# EAGLE design Lone Sleeper (EAGLE 9.5.2)
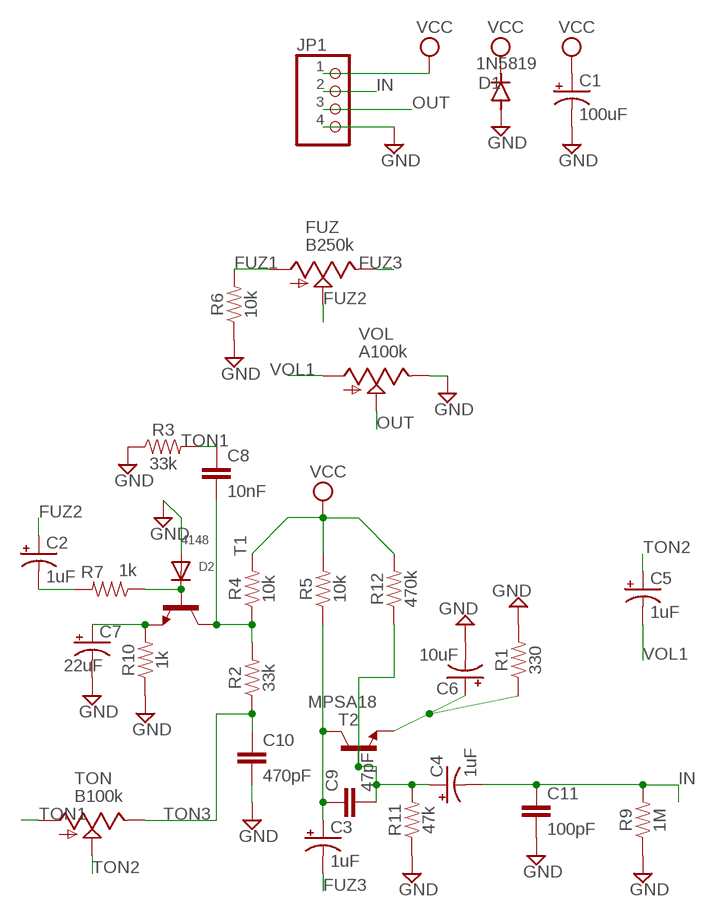
[diagram p0: schematic, sheet 1]

## Parts
C1  100uF  CAP_SMD+THRUPAN_B  [PAN_B_SMD+THRU]
C2  1uF  CAP_SMD+THRUPAN_B  [PAN_B_SMD+THRU]
C3  1uF  CAP_SMD+THRUPAN_B  [PAN_B_SMD+THRU]
C4  1uF  CAP_SMD+THRUPAN_B  [PAN_B_SMD+THRU]
C5  1uF  CAP_SMD+THRUPAN_B  [PAN_B_SMD+THRU]
C6  10uF  CAP_SMD+THRUPAN_B  [PAN_B_SMD+THRU]
C7  22uF  CAP_SMD+THRUPAN_B  [PAN_B_SMD+THRU]
C8  10nF  10NF-0603-50V-10%  [0603]
C9  47pF  47PF-0603-50V-5%  [0603]
C10  470pF  470PF-0603-50V-5%  [0603]
C11  100pF  100PF-0603-50V-5%  [0603]
D1  1N5819  DIODE-SOD123  [SOD123]
D2  4148  DIODESOD-123  [SOD-123]
FUZ  B250k  9MM_SNAP-IN_POT_  [9MM_SNAP-IN_POT]
JP1  PINHD-1X4  [1X04]
R1  330  330OHM-0603-1/10W-1%  [0603]
R2  33k  33KOHM-0603-1/10W-1%  [0603]
R3  33k  33KOHM-0603-1/10W-1%  [0603]
R4  10k  10KOHM-0603-1/10W-1%  [0603]
R5  10k  10KOHM-0603-1/10W-1%  [0603]
R6  10k  10KOHM-0603-1/10W-1%  [0603]
R7  1k  1KOHM-0603-1/10W-1%  [0603]
R9  1M  1MOHM-0603-1/4W-5%  [0603]
R10  1k  1KOHM-0603-1/10W-1%  [0603]
R11  47k  47KOHM-0603-1/10W-1%  [0603]
R12  470k  RESISTOR0603  [0603]
T1  -NPN-TO5  [TO5]
T2  MPSA18  -NPN-TO92-EBC  [TO92-EBC]
TON  B100k  9MM_SNAP-IN_POT_  [9MM_SNAP-IN_POT]
VOL  A100k  9MM_SNAP-IN_POT_  [9MM_SNAP-IN_POT]

## Nets
FUZ1: FUZ.1(A) R6.2
FUZ2: C2.+ C2.++(+) FUZ.2(S)
FUZ3: C3.- C3.--(-) FUZ.3(E)
GND: C1.- C1.--(-) C6.- C6.--(-) C7.- C7.--(-) C10.2 C11.2 D1.A D2.A JP1.4 R1.2 R3.1 R6.1 R9.1 R10.1 R11.1 VOL.3(E)
IN: C4.- C4.--(-) C11.1 JP1.2 R9.2
N$1: C8.2 R2.2 R4.1 T1.3(C)
N$2: C7.+ C7.++(+) R10.2 T1.1(E)
N$3: D2.C R7.1 T1.2(B)
N$4: C2.- C2.--(-) R7.2
N$5: C3.+ C3.++(+) C9.1 R5.1 T2.C
N$6: C4.+ C4.++(+) C9.2 R11.2 R12.1 T2.B
N$7: C6.+ C6.++(+) R1.1 T2.E
OUT: JP1.3 VOL.2(S)
TON1: C8.1 R3.2 TON.1(A)
TON2: C5.+ C5.++(+) TON.2(S)
TON3: C10.1 R2.1 TON.3(E)
VCC: C1.+ C1.++(+) D1.C JP1.1 R4.2 R5.2 R12.2
VOL1: C5.- C5.--(-) VOL.1(A)

## Library data of the parts
C1-C7 = MusicThingModular:CAP_SMD+THRU
C8 = SparkFun-Capacitors:10NF: 0.01uF/10nF/10,000pF ceramic capacitors A capacitor is a passive two-terminal electrical component used to store electrical energy temporarily in an electric field. CAP-09321; PROD_ID: CAP-00867
C9 = SparkFun-Capacitors:47PF: 47pF ceramic capacitors A capacitor is a passive two-terminal electrical component used to store electrical energy temporarily in an electric field.; PROD_ID: CAP-08913
C10 = SparkFun-Capacitors:470PF: 470pF ceramic capacitors A capacitor is a passive two-terminal electrical component used to store electrical energy temporarily in an electric field.; PROD_ID: CAP-07884
C11 = SparkFun-Capacitors:100PF: 100pF/0.1nF ceramic capacitors A capacitor is a passive two-terminal electrical component used to store electrical energy temporarily in an electric field.; PROD_ID: CAP-07883
D1 = diode:DIODE-: DIODE
D2 = adafruit:DIODE: Diode SMADIODE - SMA Surface Mount Package 20V 1A Schottky Diode Digikey: 641-1014-6-ND DO-1N4148 - Through Hole Small Current Diode SOD-123 20V 1 A (.5mV Vf) Schottky Diode - Digikey: MBRX120TPMSCT-ND SOD-323 10V 570mA (.38mV Vf, 3ns) Schottky Diode - Digikey: ZLLS410CT-ND SOD-523 30V 30mA Schottky Diode (RB751S-40TE61) - Digikey: RB751S-40TE61CT-ND SOT23-R/W - SOT23 Package (R = Solder Paste/Reflow Ovens, W = Hand-Soldering) BAT54Film 40V 300mA - Digikey: 497-7162-1-ND
FUZ TON VOL = MusicThingModular:9MM_SNAP-IN_POT: 9mm vertical snap-in pot, Alpha / Panasonic style
JP1 = Connector:PINHD-1X4: PIN HEADER; CATEGORY: CONNECTOR; SUB-CATEGORY: PIN-HEADER
R1 = SparkFun-Resistors:330OHM: 330Ω resistor A resistor is a passive two-terminal electrical component that implements electrical resistance as a circuit element. Resistors act to reduce current flow, and, at the same time, act to lower voltage levels within circuits. - Wikipedia; PROD_ID: RES-00818
R2 R3 = SparkFun-Resistors:33KOHM: 33kΩ resistor A resistor is a passive two-terminal electrical component that implements electrical resistance as a circuit element. Resistors act to reduce current flow, and, at the same time, act to lower voltage levels within circuits. - Wikipedia; PROD_ID: RES-08416
R4-R6 = SparkFun-Resistors:10KOHM: 10kΩ resistor A resistor is a passive two-terminal electrical component that implements electrical resistance as a circuit element. Resistors act to reduce current flow, and, at the same time, act to lower voltage levels within circuits. - Wikipedia; PROD_ID: RES-00824
R7 R10 = SparkFun-Resistors:1KOHM: 1kΩ resistor A resistor is a passive two-terminal electrical component that implements electrical resistance as a circuit element. Resistors act to reduce current flow, and, at the same time, act to lower voltage levels within circuits. - Wikipedia; PROD_ID: RES-07856
R9 = SparkFun-Resistors:1MOHM: 1MΩ resistor A resistor is a passive two-terminal electrical component that implements electrical resistance as a circuit element. Resistors act to reduce current flow, and, at the same time, act to lower voltage levels within circuits. - Wikipedia; PROD_ID: RES-07868
R11 = SparkFun-Resistors:47KOHM: 47kΩ resistor A resistor is a passive two-terminal electrical component that implements electrical resistance as a circuit element. Resistors act to reduce current flow, and, at the same time, act to lower voltage levels within circuits. - Wikipedia; PROD_ID: RES-07871
R12 = SparkFun-Resistors:RESISTOR: Generic Resistor Package
T1 T2 = MusicThingModular:*-NPN-: NPN Transistror BF959 corrected 2008.03.06

## Board
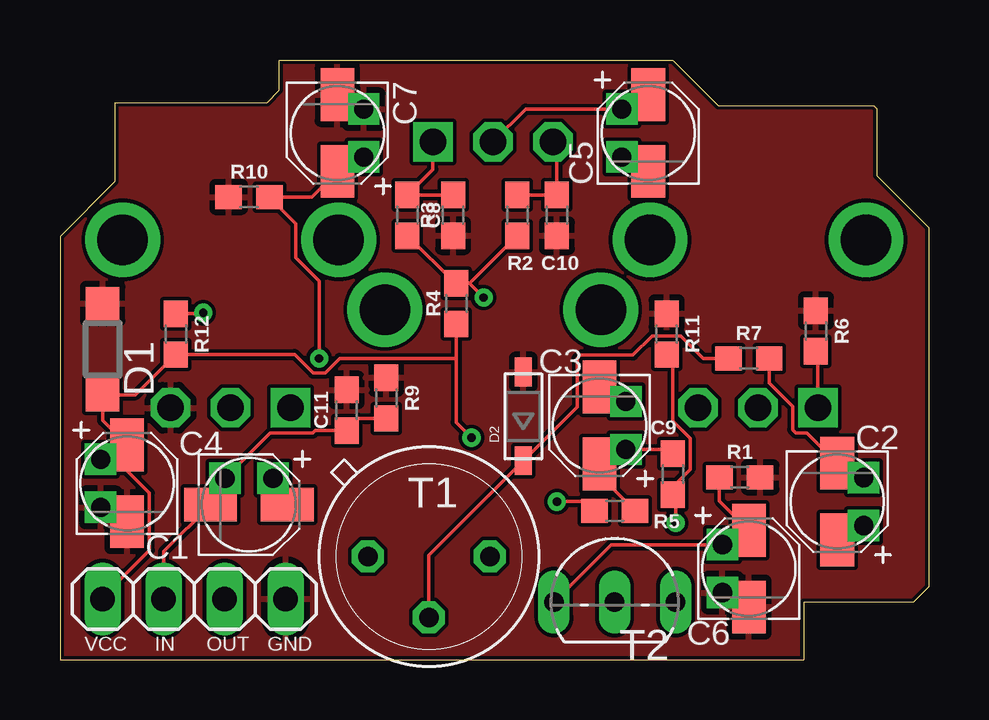
[diagram p1: board, top side]
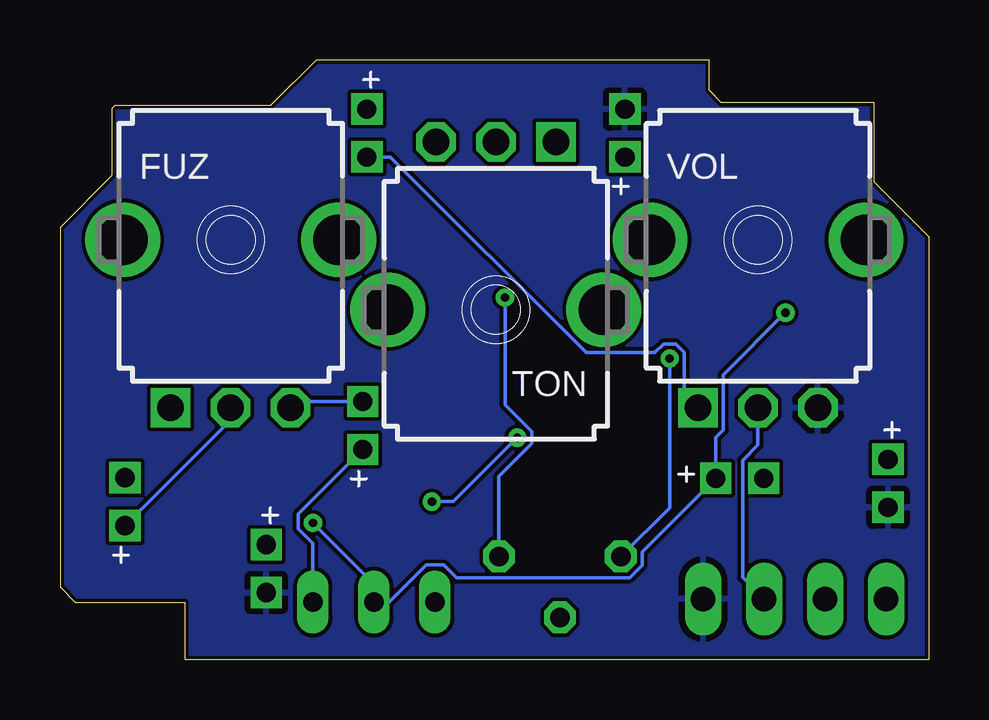
[diagram p2: board, bottom side, seen from below]

Size 36.2 x 25.02 mm. Coordinates in mm from the lower left corner, seen from the top.
Outline: 0,0 30.99,0 30.99,2.41 35.56,2.41 36.2,3.05 36.2,18.03 34.04,20.19 34.04,22.99 33.91,23.11 27.43,23.11 25.53,25.02 9.14,25.02 9.14,23.75 8.64,23.24 2.29,23.24 2.29,19.94 0,17.65 0,0
Copper layers (1*16): Top 0.035mm / dielectric 1.5mm / Bottom 0.035mm
Design rules "default *": minimum track width 6mil, minimum drill 0.35mm, track to track 6mil, track to pad 6mil, pad to pad 6mil, via to via 6mil, smd to smd 6mil, copper to edge 6mil, drill to drill 6mil, minimum pad ring 10mil, minimum via ring 8mil, stop-mask expansion 4mil, vias tented up to drill 0mil, thermal gap 10mil

### Footprints (pad centres in the part's own frame; a part is rotated, then mirrored left to right if it is on the bottom)
PAN_B_SMD+THRU = smd 2.2 x 1.4: + 1.6,0; - -1.6,0 | drill 0.8 pad 0.9 square: ++ 1,1.1; -- -1,1.1
0603 = smd 1.1 x 1: 1 -0.85,0; 2 0.85,0
SOD123 = smd 1.4 x 1.4: A 1.9,0; C -1.9,0
SOD-123 = smd 1.2 x 0.7: A 1.85,0; C -1.85,0
9MM_SNAP-IN_POT = drill 1.1 square: 1 -2.5,-7 | drill 1.1 octagon: 2 0,-7; 3 2.5,-7 | drill 2.1 pad 2.794: CHASSIS1 -4.5,0; CHASSIS2 4.5,0
1X04 = drill 1.016 long: 1 -3.81,0; 2 -1.27,0; 3 1.27,0; 4 3.81,0
TO5 = drill 0.813 octagon: 1 0,-2.54; 2 2.54,0; 3 0,2.54
TO92-EBC = drill 0.813 long: B 0,-1.27; C 2.54,-1.27; E -2.54,-1.27

### Placement (x,y rotation side)
C1  2.79,7.37 90 top
C2  32.38,6.6 270 top
C3  22.48,9.78 270 top
C4  7.87,6.48 0 top
C5  24.51,21.97 90 top
C6  28.7,3.81 90 top
C7  11.56,21.97 270 top
C8  14.48,18.54 270 top
C9  25.53,7.75 270 top
C10  20.7,18.54 270 top
C11  11.94,10.41 90 top
D1  1.78,12.95 90 top
D2  19.3,10.16 90 top
FUZ  29.08,17.52 0 bottom
JP1  5.59,2.54 0 top
R1  28.32,7.62 0 top
R2  19.05,18.54 270 top
R3  16.38,18.54 90 top
R4  16.51,14.86 270 top
R5  23.11,6.22 180 top
R6  31.5,13.72 270 top
R7  28.7,12.57 0 top
R9  13.59,10.92 270 top
R10  7.87,19.3 0 top
R11  25.27,13.59 270 top
R12  4.83,13.59 270 top
T1  15.37,4.32 270 top
T2  23.11,3.68 0 top
TON  18.03,14.61 180 bottom
VOL  7.11,17.52 0 bottom

### Tracks (layer width: path | path; a pad name or v marks a point on that pad's centre or on a via)
FUZ1
  Top 0.152: R6.2 31.58,12.78 FUZ.1
FUZ2
  Top 0.152: C2.+ 32.98,5.6 C2.++
  Bottom 0.152: C2.++ 29.08,10.01 FUZ.2
FUZ3
  Top 0.152: C3.-- 23.08,10.78 C3.-
  Bottom 0.152: C3.-- 26.32,10.78 FUZ.3
GND
  pour Top: -0.51,26.16 -0.51,-0.13 -0.13,-0.51 36.83,-0.51 36.83,26.04 36.7,26.16
  pour Bottom: -0.38,26.04 -0.38,-0.13 0,-0.51 36.83,-0.51 36.96,-0.38 36.96,25.53 36.07,26.42 0,26.42
IN
  Top 0.152: JP1.2 4.32,4.52 C4.- 6.27,6.98 C4.-- 8.76,9.46 10.53,9.46 10.63,9.56 C11.1 12.45,10.07 R9.2
N$1  (via drill 0.35)
  Top 0.152: C8.2 16.46,15.71 R4.1 | R4.1 17.07,15.71 R2.2 | v17.65,15.11 17.06,15.71 R4.1
  Bottom 0.152: T1.3 17.91,7.65 16.54,9.02 16.54,9.52 17.65,10.64 v17.65,15.11
N$2  (via drill 0.35)
  Top 0.152: C7.++ 12.06,20.37 C7.+ 10.49,19.3 R10.2 9.82,18.2 9.82,16.78 10.79,15.81 v10.79,12.57
  Bottom 0.152: v10.79,12.57 10.79,6.35 T1.1
N$3
  Top 0.152: R7.1 26.81,12.57 25.87,13.52 24.68,13.52 23.87,12.71 21.68,12.71 21.55,12.57 21.55,10.56 D2.C 15.37,4.37 T1.2
N$4
  Top 0.152: C2.-- 32.88,8.2 C2.- 31.12,9.46 30.66,9.46 30.53,9.6 30.53,10.56 29.55,11.54 R7.2
N$5
  Top 0.152: R5.1 22.48,7.71 C3.+ 23.08,8.78 C3.++ 25.34,8.78 C9.1
  Bottom 0.152: T2.C 25.65,4.86 26.26,5.46 26.26,6.1 C3.++
N$6  (via drill 0.35)
  Top 0.152: C9.2 25.55,6.88 | 25.55,6.88 25.65,6.77 v25.65,5.71 | C4.+ 8.87,7.08 C4.++ | v5.97,14.48 5.93,14.44 R12.1 | 25.55,6.88 25.55,7.24 26.26,7.95 26.26,9.24 25.53,9.97 25.53,12.48 R11.2
  Bottom 0.152: v25.65,5.71 23.11,3.17 T2.B 22.49,2.41 20.94,3.96 20.21,3.96 19.67,3.43 12.46,3.43 11.94,3.95 11.94,4.51 C4.++ 8.87,9.28 8.56,9.6 8.56,11.89 v5.97,14.48
N$7
  Top 0.152: R1.1 27.47,6.64 C6.+ 28.2,5.41 C6.++ 22.97,4.81 T2.E
OUT
  Bottom 0.152: VOL.2 7.11,8.97 7.76,8.33 7.76,3.44 JP1.3
TON1
  Top 0.152: R3.2 C8.1 15.53,20.45 TON.1
TON2
  Top 0.152: TON.2 19.4,22.97 C5.++ 24.01,23.57 C5.+
TON3
  Top 0.152: TON.3 20.7,21.44 C10.1 R2.1
VCC  (via drill 0.35)
  Top 0.152: JP1.1 1.78,2.63 3.72,4.57 3.72,6.96 2.79,7.89 C1.+ | C1.+ 2.19,8.37 C1.++ | C1.+ 1.78,9.98 D1.C 3.14,11.05 R12.2 9.77,12.74 10.54,11.97 11.05,11.97 11.65,12.57 16.51,12.57 | R4.2 16.51,12.57 | 16.51,12.57 16.51,9.91 v17.14,9.27 | v20.7,6.6 21.88,6.6 R5.2
  Bottom 0.152: v17.14,9.27 19.81,6.6 v20.7,6.6
VOL1
  Top 0.152: C5.- 24.01,20.37 C5.--
  Bottom 0.152: VOL.1 10.19,11.1 10.19,12.82 10.54,13.18 11.05,13.18 11.41,12.82 14.27,12.82 22.43,20.97 C5.--

### Text on the board
tPlace: VCC | IN | OUT | GND